# Altium schematic sheet [01] - Index.SchDoc: Index
size A3; Date: N.A.; ApprovedBy: N.A.; CheckedBy: N.A.; Author: N.A.; CompanyName: Johannes Berndorfer; DrawnBy: JBE; Organization: N.A.; Address1: Konrad Grefe Gasse 22; Address2: 1230 Wien; Address3: AUSTRIA; Address4: N.A.; DocumentNumber: 1; Revision: A; SheetNumber: 1; SheetTotal: 2; ProjectTitle: 10P50MIL Debugger Adapter Board; Reviewer: -; Time: N.A.; ImagePath: N.A.; Application_BuildNumber: N.A.
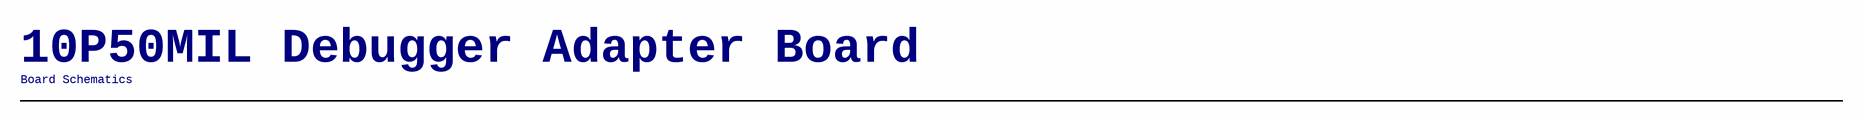
[diagram p0: [01] - Index.SchDoc]

## Notes on the sheet
- 10P50MIL Debugger Adapter Board
- Board Schematics
- Title:
- Project:
- Document Nr.:
- Revision:
- Date:
- Drawn By:
- Time:
- Reviewed By:
- Sheet
- of
- Size:
- A3
- Variant:
- File: